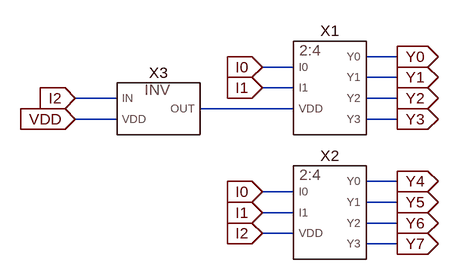
[diagram p0: schematic Draft1.asc]
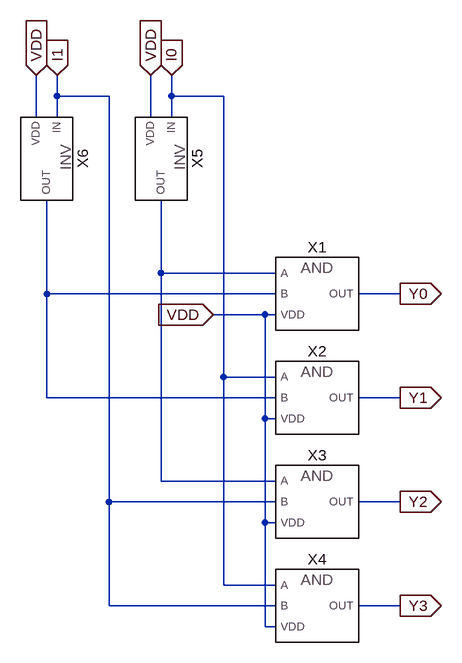
[diagram p1: sub-circuit dec2to4cmos.asc]
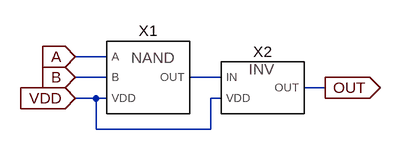
[diagram p2: sub-circuit andcmos.asc]
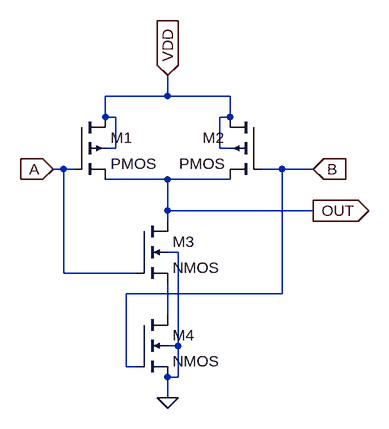
[diagram p3: sub-circuit nandcmos.asc]
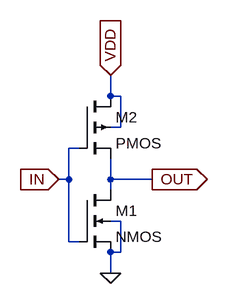
[diagram p4: sub-circuit invcmos.asc]
Draft1.asc, the LTspice schematic file:
Version 4
SHEET 1 880 680
WIRE 320 48 272 48
WIRE 160 64 112 64
WIRE 320 80 272 80
WIRE 160 96 112 96
WIRE -112 112 -176 112
WIRE 320 112 272 112
WIRE 160 128 16 128
WIRE -112 144 -176 144
WIRE 320 144 272 144
WIRE 320 240 272 240
WIRE 160 256 112 256
WIRE 320 272 272 272
WIRE 160 288 112 288
WIRE 320 304 272 304
WIRE 160 320 112 320
WIRE 320 336 272 336
FLAG 320 48 Y0
IOPIN 320 48 Out
FLAG 320 80 Y1
IOPIN 320 80 Out
FLAG 320 112 Y2
IOPIN 320 112 Out
FLAG 320 144 Y3
IOPIN 320 144 Out
FLAG 320 240 Y4
IOPIN 320 240 Out
FLAG 320 272 Y5
IOPIN 320 272 Out
FLAG 320 304 Y6
IOPIN 320 304 Out
FLAG 320 336 Y7
IOPIN 320 336 Out
FLAG 112 64 I0
IOPIN 112 64 In
FLAG 112 96 I1
IOPIN 112 96 In
FLAG 112 256 I0
IOPIN 112 256 In
FLAG 112 288 I1
IOPIN 112 288 In
FLAG -176 112 I2
IOPIN -176 112 In
FLAG -176 144 VDD
IOPIN -176 144 In
FLAG 112 320 I2
IOPIN 112 320 In
SYMBOL Dec2to4CMOS 208 96 R0
SYMATTR InstName X1
SYMBOL Dec2to4CMOS 208 288 R0
SYMATTR InstName X2
SYMBOL InvCMOS -48 128 R0
SYMATTR InstName X3

dec2to4cmos.asc, the sub-circuit schematic file:
Version 4
SHEET 1 880 680
WIRE -64 -208 -64 -240
WIRE 16 -208 -64 -208
WIRE 112 -208 112 -240
WIRE 192 -208 112 -208
WIRE -96 -176 -96 -240
WIRE -64 -176 -64 -208
WIRE 80 -176 80 -240
WIRE 112 -176 112 -208
WIRE 96 64 96 -48
WIRE 272 64 96 64
WIRE -80 96 -80 -48
WIRE 272 96 -80 96
WIRE 464 96 400 96
WIRE 256 128 176 128
WIRE 272 128 256 128
WIRE 192 224 192 -208
WIRE 272 224 192 224
WIRE -80 256 -80 96
WIRE 272 256 -80 256
WIRE 464 256 400 256
WIRE 256 288 256 128
WIRE 272 288 256 288
WIRE 96 384 96 64
WIRE 272 384 96 384
WIRE 16 416 16 -208
WIRE 272 416 16 416
WIRE 464 416 400 416
WIRE 256 448 256 288
WIRE 272 448 256 448
WIRE 192 544 192 224
WIRE 272 544 192 544
WIRE 16 576 16 416
WIRE 272 576 16 576
WIRE 464 576 400 576
WIRE 256 608 256 448
WIRE 272 608 256 608
FLAG 112 -240 I0
IOPIN 112 -240 In
FLAG 80 -240 VDD
IOPIN 80 -240 In
FLAG -64 -240 I1
IOPIN -64 -240 In
FLAG -96 -240 VDD
IOPIN -96 -240 In
FLAG 176 128 VDD
IOPIN 176 128 In
FLAG 464 96 Y0
IOPIN 464 96 Out
FLAG 464 256 Y1
IOPIN 464 256 Out
FLAG 464 416 Y2
IOPIN 464 416 Out
FLAG 464 576 Y3
IOPIN 464 576 Out
SYMBOL AndCMOS 336 96 R0
SYMATTR InstName X1
SYMBOL AndCMOS 336 256 R0
SYMATTR InstName X2
SYMBOL AndCMOS 336 416 R0
SYMATTR InstName X3
SYMBOL AndCMOS 336 576 R0
SYMATTR InstName X4
SYMBOL InvCMOS 96 -112 R90
SYMATTR InstName X5
SYMBOL InvCMOS -80 -112 R90
SYMATTR InstName X6

andcmos.asc, the sub-circuit schematic file:
Version 4
SHEET 1 880 680
WIRE 112 112 64 112
WIRE 112 144 64 144
WIRE 288 144 240 144
WIRE 448 160 416 160
WIRE 96 176 64 176
WIRE 112 176 96 176
WIRE 288 176 272 176
WIRE 96 224 96 176
WIRE 272 224 272 176
WIRE 272 224 96 224
FLAG 64 112 A
IOPIN 64 112 In
FLAG 64 144 B
IOPIN 64 144 In
FLAG 64 176 VDD
IOPIN 64 176 In
FLAG 448 160 OUT
IOPIN 448 160 Out
SYMBOL NandCMOS 176 144 R0
SYMATTR InstName X1
SYMBOL InvCMOS 352 160 R0
SYMATTR InstName X2

nandcmos.asc, the sub-circuit schematic file:
Version 4
SHEET 1 880 680
WIRE -112 -160 -112 -192
WIRE -112 -160 -208 -160
WIRE -16 -160 -112 -160
WIRE -208 -128 -208 -160
WIRE -192 -128 -208 -128
WIRE -16 -128 -16 -160
WIRE -16 -128 -32 -128
WIRE -192 -80 -192 -128
WIRE -192 -80 -208 -80
WIRE -32 -80 -32 -128
WIRE -16 -80 -32 -80
WIRE -272 -48 -288 -48
WIRE -256 -48 -272 -48
WIRE 64 -48 32 -48
WIRE 112 -48 64 -48
WIRE -112 -32 -208 -32
WIRE -16 -32 -112 -32
WIRE -112 16 -112 -32
WIRE 112 16 -112 16
WIRE -112 32 -112 16
WIRE -96 80 -112 80
WIRE -272 112 -272 -48
WIRE -160 112 -272 112
WIRE 64 144 64 -48
WIRE 64 144 -176 144
WIRE -112 176 -112 128
WIRE -96 224 -96 80
WIRE -96 224 -112 224
WIRE -176 256 -176 144
WIRE -160 256 -176 256
WIRE -96 272 -96 224
WIRE -96 272 -112 272
WIRE -112 304 -112 272
FLAG -112 304 0
FLAG -112 -192 VDD
IOPIN -112 -192 In
FLAG -288 -48 A
IOPIN -288 -48 In
FLAG 112 -48 B
IOPIN 112 -48 In
FLAG 112 16 OUT
IOPIN 112 16 Out
SYMBOL pmos4 -256 -128 R0
SYMATTR InstName M1
SYMATTR Value2 l=65nm w=162.5nm
SYMBOL pmos4 32 -128 M0
SYMATTR InstName M2
SYMATTR Value2 l=65nm w=162.5nm
SYMBOL nmos4 -160 32 R0
SYMATTR InstName M3
SYMATTR Value2 l=65nm w=65nm
SYMBOL nmos4 -160 176 R0
SYMATTR InstName M4
SYMATTR Value2 l=65nm w=65nm

invcmos.asc, the sub-circuit schematic file:
Version 4
SHEET 1 880 680
WIRE 208 32 208 0
WIRE 224 32 208 32
WIRE 224 80 224 32
WIRE 224 80 208 80
WIRE 160 112 144 112
WIRE 144 160 144 112
WIRE 144 160 128 160
WIRE 208 160 208 128
WIRE 272 160 208 160
WIRE 208 176 208 160
WIRE 224 224 208 224
WIRE 144 256 144 160
WIRE 160 256 144 256
WIRE 224 272 224 224
WIRE 224 272 208 272
WIRE 208 304 208 272
FLAG 208 304 0
FLAG 208 0 VDD
IOPIN 208 0 In
FLAG 128 160 IN
IOPIN 128 160 In
FLAG 272 160 OUT
IOPIN 272 160 Out
SYMBOL nmos4 160 176 R0
SYMATTR InstName M1
SYMATTR Value2 l=65nm w=65nm
SYMBOL pmos4 160 32 R0
SYMATTR InstName M2
SYMATTR Value2 l=65nm w=162.5nm

The netlist it stands for:
* Draft1.asc
XX1 I0 I1 N001 Y0 Y1 Y2 Y3 dec2to4cmos
XX2 I0 I1 I2 Y4 Y5 Y6 Y7 dec2to4cmos
XX3 I2 VDD N001 invcmos

* block symbol definitions
.subckt dec2to4cmos I0 I1 VDD Y0 Y1 Y2 Y3
XX1 N001 N002 VDD Y0 andcmos
XX2 I0 N002 VDD Y1 andcmos
XX3 N001 I1 VDD Y2 andcmos
XX4 I0 I1 VDD Y3 andcmos
XX5 I0 VDD N001 invcmos
XX6 I1 VDD N002 invcmos
.ends dec2to4cmos

.subckt andcmos A B VDD OUT
XX1 A B VDD N001 nandcmos
XX2 N001 VDD OUT invcmos
.ends andcmos

.subckt nandcmos A B VDD OUT
M1 VDD A OUT VDD PMOS l=65nm w=162.5nm
M2 VDD B OUT VDD PMOS l=65nm w=162.5nm
M3 OUT A N001 0 NMOS l=65nm w=65nm
M4 N001 B 0 0 NMOS l=65nm w=65nm
.ends nandcmos

.subckt invcmos IN VDD OUT
M1 OUT IN 0 0 NMOS l=65nm w=65nm
M2 VDD IN OUT VDD PMOS l=65nm w=162.5nm
.ends invcmos

.model NMOS NMOS
.model PMOS PMOS
.lib standard.mos
.backanno
.end